# EAGLE design Testadapter (EAGLE 9.6.2)
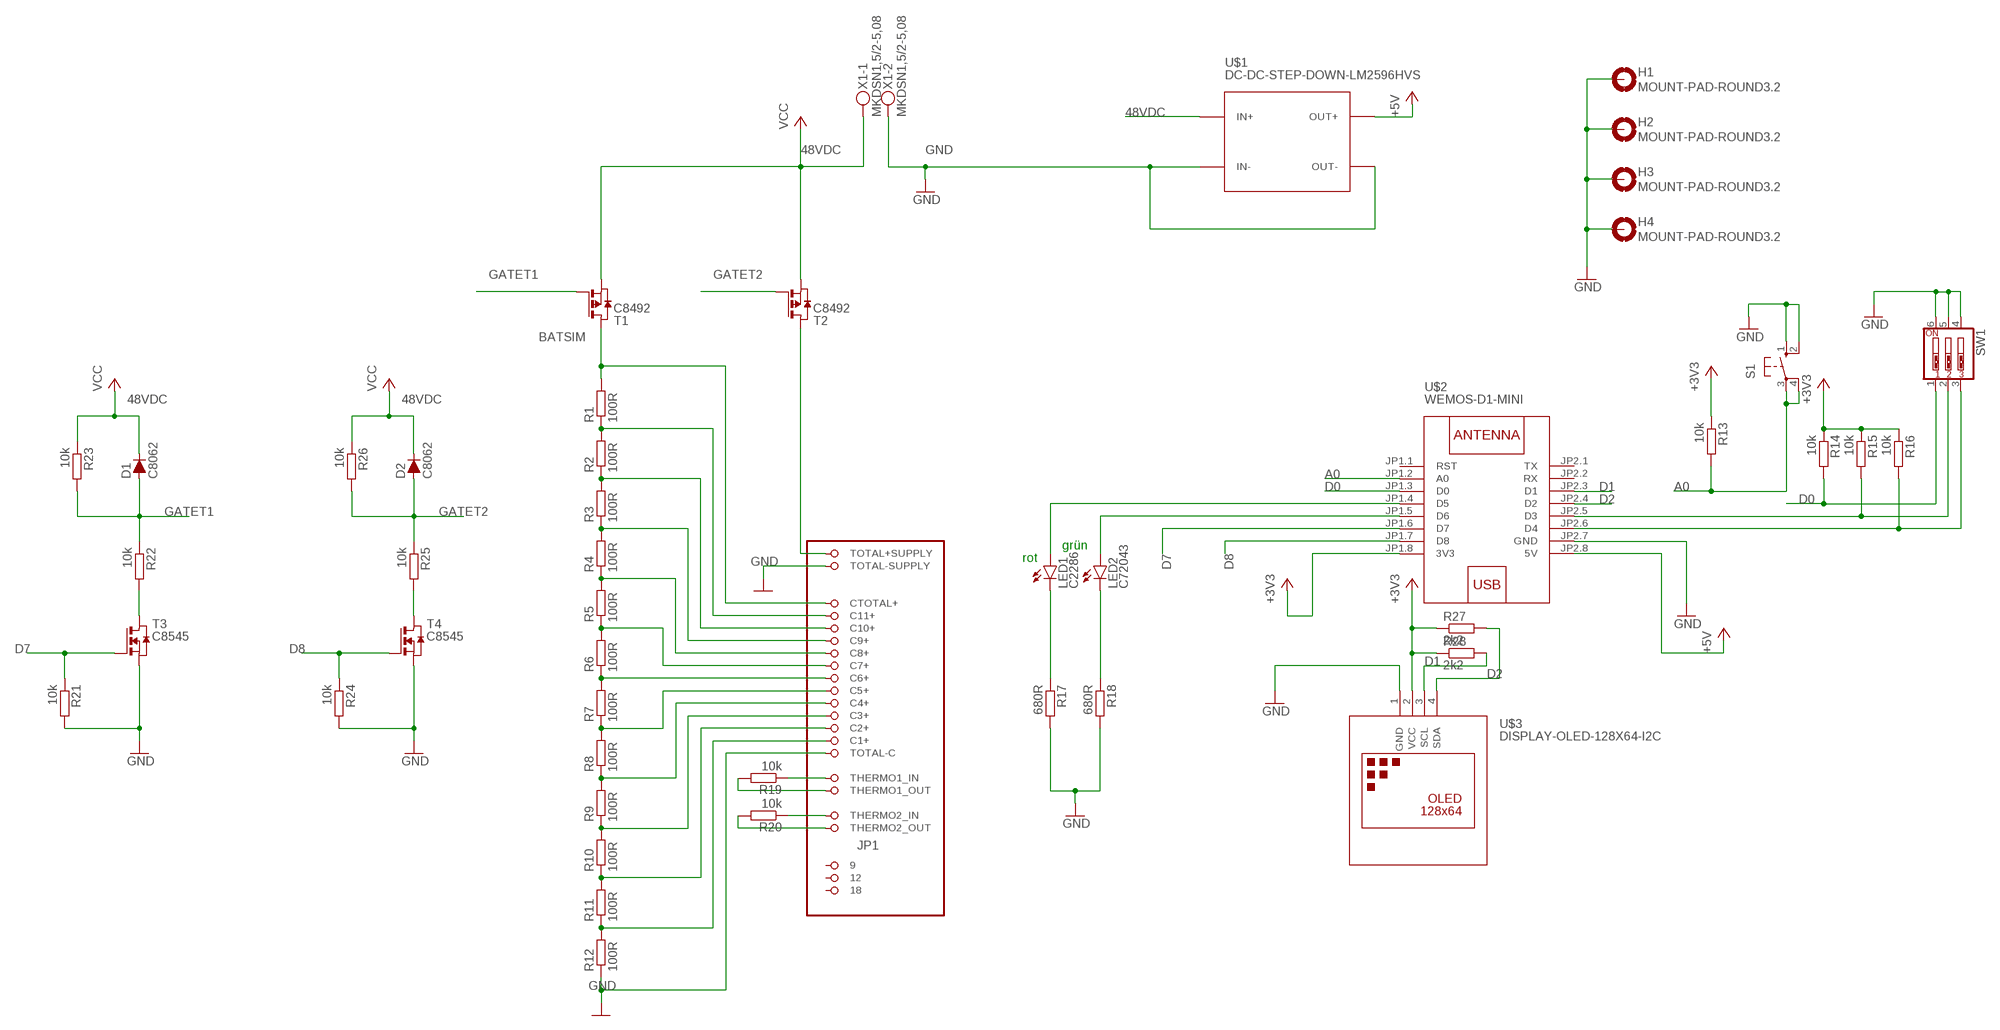
[diagram p0: schematic, sheet 1]

## Parts
D1  C8062  D-FILL-MLL-34  [MELF-MLL34]
D2  C8062  D-FILL-MLL-34  [MELF-MLL34]
H1  MOUNT-PAD-ROUND3.2  [3,2-PAD]
H2  MOUNT-PAD-ROUND3.2  [3,2-PAD]
H3  MOUNT-PAD-ROUND3.2  [3,2-PAD]
H4  MOUNT-PAD-ROUND3.2  [3,2-PAD]
JP1  PINHD-2X11_MEB12S_MODULSEITE_SMD  [2X11_MEB12S_MODULSEITE_SMD]
LED1  C2286  LEDCHIP-LED0603  [CHIP-LED0603]
LED2  C72043  LEDCHIP-LED0603  [CHIP-LED0603]
R1  100R  R-EU_R0805  [R0805]
R2  100R  R-EU_R0805  [R0805]
R3  100R  R-EU_R0805  [R0805]
R4  100R  R-EU_R0805  [R0805]
R5  100R  R-EU_R0805  [R0805]
R6  100R  R-EU_R0805  [R0805]
R7  100R  R-EU_R0805  [R0805]
R8  100R  R-EU_R0805  [R0805]
R9  100R  R-EU_R0805  [R0805]
R10  100R  R-EU_R0805  [R0805]
R11  100R  R-EU_R0805  [R0805]
R12  100R  R-EU_R0805  [R0805]
R13  10k  R-EU_R0805  [R0805]
R14  10k  R-EU_R0805  [R0805]
R15  10k  R-EU_R0805  [R0805]
R16  10k  R-EU_R0805  [R0805]
R17  680R  R-EU_R0805  [R0805]
R18  680R  R-EU_R0805  [R0805]
R19  10k  R-EU_R0805  [R0805]
R20  10k  R-EU_R0805  [R0805]
R21  10k  R-EU_R0805  [R0805]
R22  10k  R-EU_R0805  [R0805]
R23  10k  R-EU_R0805  [R0805]
R24  10k  R-EU_R0805  [R0805]
R25  10k  R-EU_R0805  [R0805]
R26  10k  R-EU_R0805  [R0805]
R27  2k2  R-EU_R0805  [R0805]
R28  2k2  R-EU_R0805  [R0805]
S1  10-XX  [B3F-10XX]
SW1  SW_DIP-3  [EDG-03]
T1  C8492  PMOSSOT23  [SOT-23]
T2  C8492  PMOSSOT23  [SOT-23]
T3  C8545  NMOSSOT23  [SOT-23]
T4  C8545  NMOSSOT23  [SOT-23]
U$1  DC-DC-STEP-DOWN-LM2596HVS  [DC-DC-STEP-DOWN-LM2596HVS]
U$2  WEMOS-D1-MINI  [WEMOS-D1-MINI]
U$3  DISPLAY-OLED-128X64-I2C  [DISPLAY-OLED-128X64-I2C]
X1  MKDSN1,5/2-5,08  [MKDSN1,5/2-5,08]

## Nets
48VDC [Supply]: D1.1(C) D2.1(C) R23.1 R26.1 T1.2(S) T2.2(S) U$1.IN+ X1.1 ; supply symbol labelled VCC
+3V3 [Supply]: R13.1 R14.1 R15.1 R16.1 R27.1 R28.1 U$2.JP1.8(3V3) U$3.2(VCC)
+5V [Supply]: U$1.OUT+ U$2.JP2.8(5V)
A0: R13.2 S1.3(P) S1.4(P1) U$2.JP1.2(A0)
BATSIM: JP1.21(CTOTAL+) R1.2 T1.1(D)
D0: R14.2 SW1.1 U$2.JP1.3(D0)
D1: R28.2 U$2.JP2.3(D1) U$3.3(SCL)
D2: R27.2 U$2.JP2.4(D2) U$3.4(SDA)
D7: R21.1 T3.3(G) U$2.JP1.6(D7)
D8: R24.1 T4.3(G) U$2.JP1.7(D8)
GATET1: D1.2(A) R22.1 R23.2 T1.3(G)
GATET2: D2.2(A) R25.1 R26.2 T2.3(G)
GND [Supply]: H1.B3,2(MOUNT) H2.B3,2(MOUNT) H3.B3,2(MOUNT) H4.B3,2(MOUNT) JP1.7(TOTAL-SUPPLY) JP1.9(TOTAL-C) R12.1 R17.2 R18.2 R21.2 R24.2 S1.1(S) S1.2(S1) SW1.4 SW1.5 SW1.6 T3.2(S) T4.2(S) U$1.IN- U$1.OUT- U$2.JP2.7(GND) U$3.1(GND) X1.2
N$1: JP1.20(C11+) R1.1 R2.2
N$2: JP1.19(C10+) R2.1 R3.2
N$3: JP1.18(C9+) R3.1 R4.2
N$4: JP1.17(C8+) R4.1 R5.2
N$5: JP1.16(C7+) R5.1 R6.2
N$6: JP1.15(C6+) R6.1 R7.2
N$7: JP1.14(C5+) R7.1 R8.2
N$8: JP1.13(C4+) R8.1 R9.2
N$9: JP1.12(C3+) R9.1 R10.2
N$10: JP1.11(C2+) R10.1 R11.2
N$11: JP1.10(C1+) R11.1 R12.2
N$14: R15.2 SW1.2 U$2.JP2.5(D3)
N$15: R16.2 SW1.3 U$2.JP2.6(D4)
N$16: LED1.C R17.1
N$17: LED2.C R18.1
N$19 [Supply]: JP1.22(TOTAL+SUPPLY) T2.1(D)
N$20: LED2.A U$2.JP1.5(D6)
N$21: LED1.A U$2.JP1.4(D5)
N$22: R22.2 T3.1(D)
N$23: R25.2 T4.1(D)
THERMO1IN: JP1.1(THERMO1_IN) R19.1
THERMO1OUT: JP1.3(THERMO1_OUT) R19.2
THERMO2_IN: JP1.2(THERMO2_IN) R20.1
THERMO2_OUT: JP1.4(THERMO2_OUT) R20.2
Unconnected: JP1.5 JP1.6 JP1.8 U$2.JP1.1(RST) U$2.JP2.1(TX) U$2.JP2.2(RX)

## Notes on the sheet
- grün
- rot

## Library data of the parts
D1 D2 = semicon-smd-ipc:D-FILL-: DIODE filled
H1-H4 = holes:MOUNT-PAD-ROUND: MOUNTING PAD, round
JP1 = con-MEB:PINHD-2X11_MEB12S_MODULSEITE: PIN HEADER
LED1 LED2 = led:LED: LED OSRAM: - CHIPLED LG R971, LG N971, LY N971, LG Q971, LY Q971, LO R971, LY R971 LH N974, LH R974 LS Q976, LO Q976, LY Q976 LO Q996 - Hyper CHIPLED LW Q18S LB Q993, LB Q99A, LB R99A - SideLED LS A670, LO A670, LY A670, LG A670, LP A670 LB A673, LV A673, LT A673, LW A673 LH A674 LY A675 LS A676, LA A676, LO A676, LY A676, LW A676 LS A679, LY A679, LG A679 - Hyper Micro SIDELED® LS Y876, LA Y876, LO Y876, LY Y876 LT Y87S - SmartLED LW L88C, LW L88S LB L89C, LB L89S, LG L890 LS L89K, LO L89K, LY L89K LS L896, LA L896, LO L896, LY L896 - TOPLED LS T670, LO T670, LY T670, LG T670, LP T670 LSG T670, LSP T670, LSY T670, LOP T670, LYG T670 LG T671, LOG T671, LSG T671 LB T673, LV T673, LT T673, LW T673 LH T674 LS T676, LA T676, LO T676, LY T676, LB T676, LH T676, LSB T676, LW T676 LB T67C, LV T67C, LT T67C, LS T67K, LO T67K, LY T67K, LW E67C LS E67B, LA E67B, LO E67B, LY E67B, LB E67C, LV E67C, LT E67C LW T67C LS T679, LY T679, LG T679 LS T770, LO T770, LY T770, LG T770, LP T770 LB T773, LV T773, LT T773, LW T773 LH T774 LS E675, LA E675, LY E675, LS T675 LS T776, LA T776, LO T776, LY T776, LB T776 LHGB T686 LT T68C, LB T68C - Hyper Mini TOPLED® LB M676 - Mini TOPLED Santana® LG M470 LS M47K, LO M47K, LY M47K Source: http://www.osram.convergy.de LUXEON: - LUMILED® LXK2-PW12-R00, LXK2-PW12-S00, LXK2-PW14-U00, LXK2-PW14-V00 LXK2-PM12-R00, LXK2-PM12-S00, LXK2-PM14-U00 LXK2-PE12-Q00, LXK2-PE12-R00, LXK2-PE12-S00, LXK2-PE14-T00, LXK2-PE14-U00 LXK2-PB12-K00, LXK2-PB12-L00, LXK2-PB12-M00, LXK2-PB14-N00, LXK2-PB14-P00, LXK2-PB14-Q00 LXK2-PR12-L00, LXK2-PR12-M00, LXK2-PR14-Q00, LXK2-PR14-R00 LXK2-PD12-Q00, LXK2-PD12-R00, LXK2-PD12-S00 LXK2-PH12-R00, LXK2-PH12-S00 LXK2-PL12-P00, LXK2-PL12-Q00, LXK2-PL12-R00 Source: www.luxeon.com KINGBRIGHT: KA-3528ASYC Source: www.kingbright.com
R1-R28 = rcl:R-EU_: RESISTOR, European symbol; SPICEPREFIX: R
S1 = switch-omron:10-XX: OMRON SWITCH; MPN: B3F-1000; OC_FARNELL: 176432; OC_NEWARK: 36M3542
SW1 = special:SW_DIP-3: DIP SWITCH
T1 T2 = zetex:PMOSSOT23: MOS FET; OC_FARNELL: unknown; OC_NEWARK: unknown
T3 T4 = zetex:NMOSSOT23: MOS FET; OC_FARNELL: unknown; OC_NEWARK: unknown
U$1 = diy-modules:DC-DC-STEP-DOWN-LM2596HVS: DC/DC Step-Down Regulator based on LM2596-ADJ chip LM2596 datasheet available here: http://www.ti.com/lit/ds/symlink/lm2596.pdf Click here to find device on ebay.com <http://www.ebay.com/sch/lm2596+power+regulator>
U$2 = diy-modules:WEMOS-D1-MINI: WEMOS D1 mini: Mini Wi-Fi Board based on ESP-8266 device More details can be found here: https://www.wemos.cc/product/d1-mini.html Click here to find device on ebay.com <http://www.ebay.com/sch/wemos+d1+mini+nodemcu>
U$3 = diy-modules:DISPLAY-OLED-128X64-I2C: 128x64 Dot Matrix OLED Module based on SSD1306 chip Variant with I2C interface More details available here: http://www.instructables.com/id/Monochrome-096-i2c-OLED-display-with-arduino-SSD13/ SSD1306 datasheet: https://cdn-shop.adafruit.com/datasheets/SSD1306.pdf Click here to find device on ebay.com <http://www.ebay.com/sch/oled+display+128x64+iic> Note: There are two variants: I2C and SPI. Search for the proper version.
X1 = con-phoenix-508:MKDSN1,5/2-5,08: MKDSN 1,5/ 2-5,08 Printklemme Nennstrom: 13,5 A Nennspannung: 250 V Rastermaß: 5,08 mm Polzahl: 2 Anschlussart: Schraubanschluss Montage: Löten Anschlussrichtung Leiter/Platine: 0 ° Artikelnummer: 1729128 Source: http://eshop.phoenixcontact.com .. 1729128.pdf

## Net classes
0 default: width 0.2 mm, clearance 0.205 mm
1 Supply: width 1 mm, clearance 0.205 mm

## Board
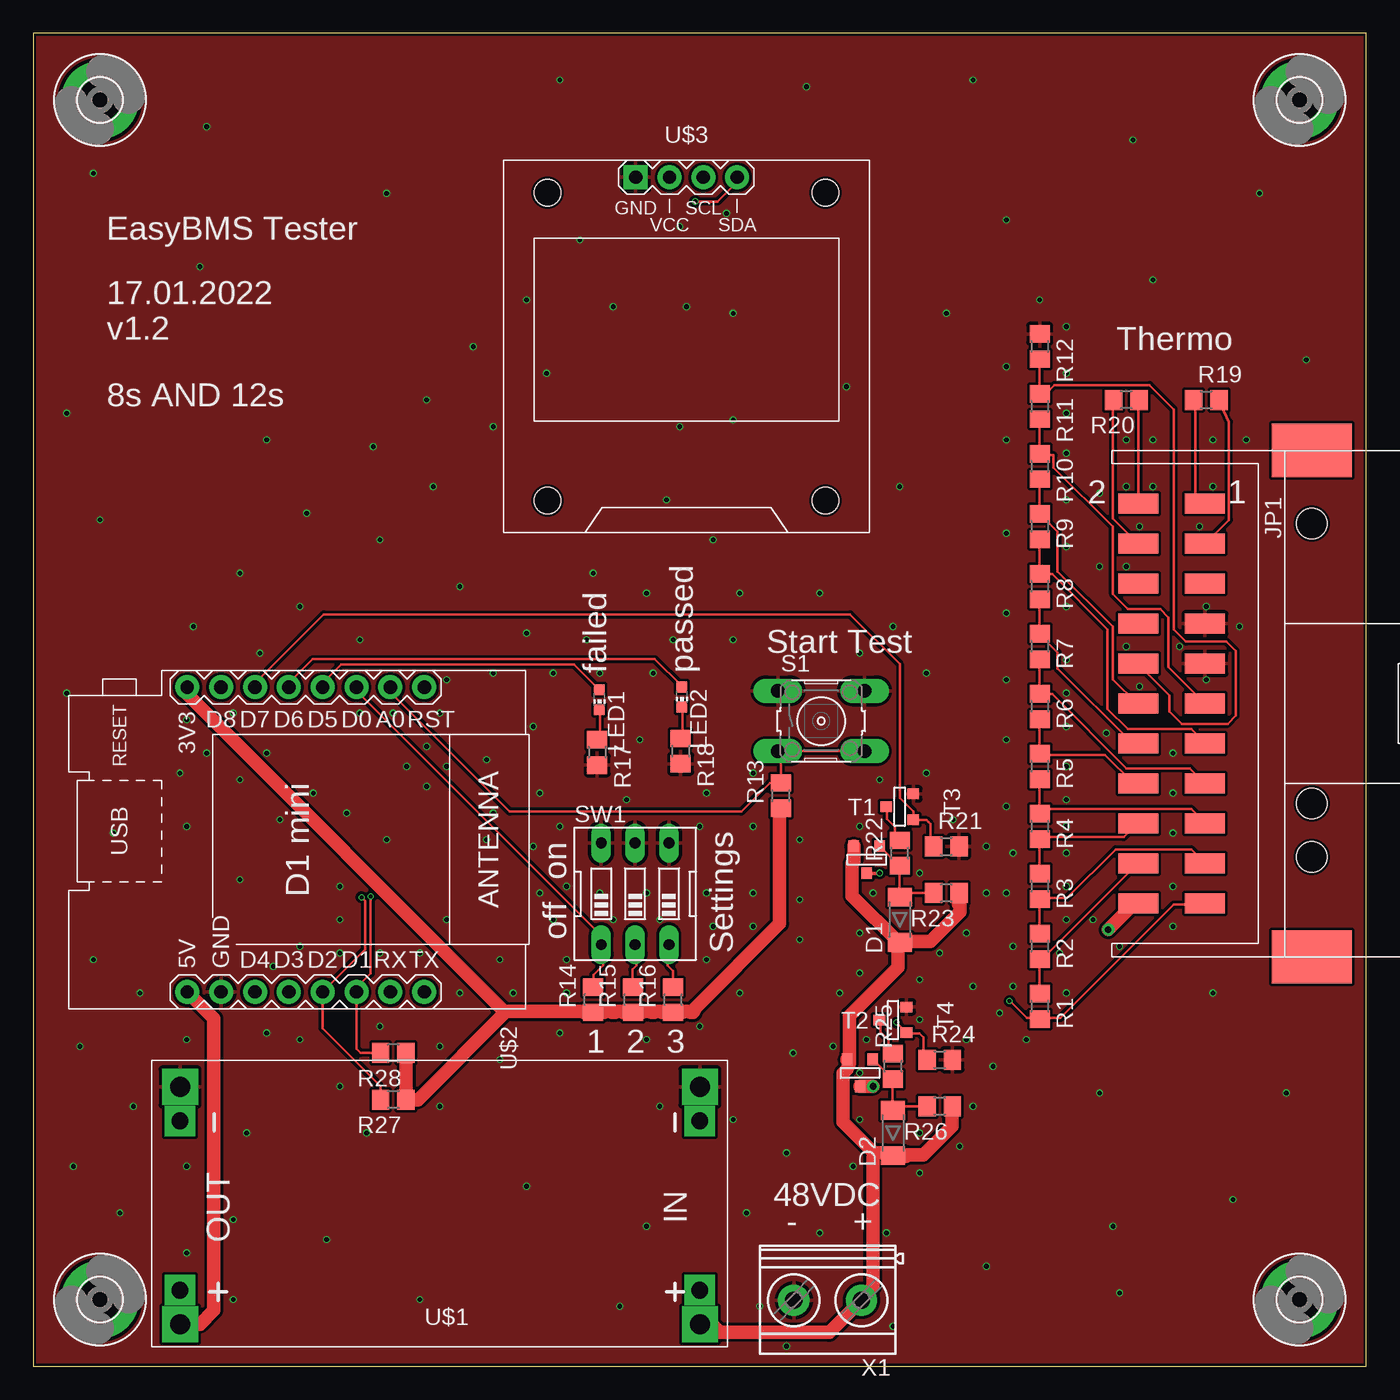
[diagram p1: board, top side]
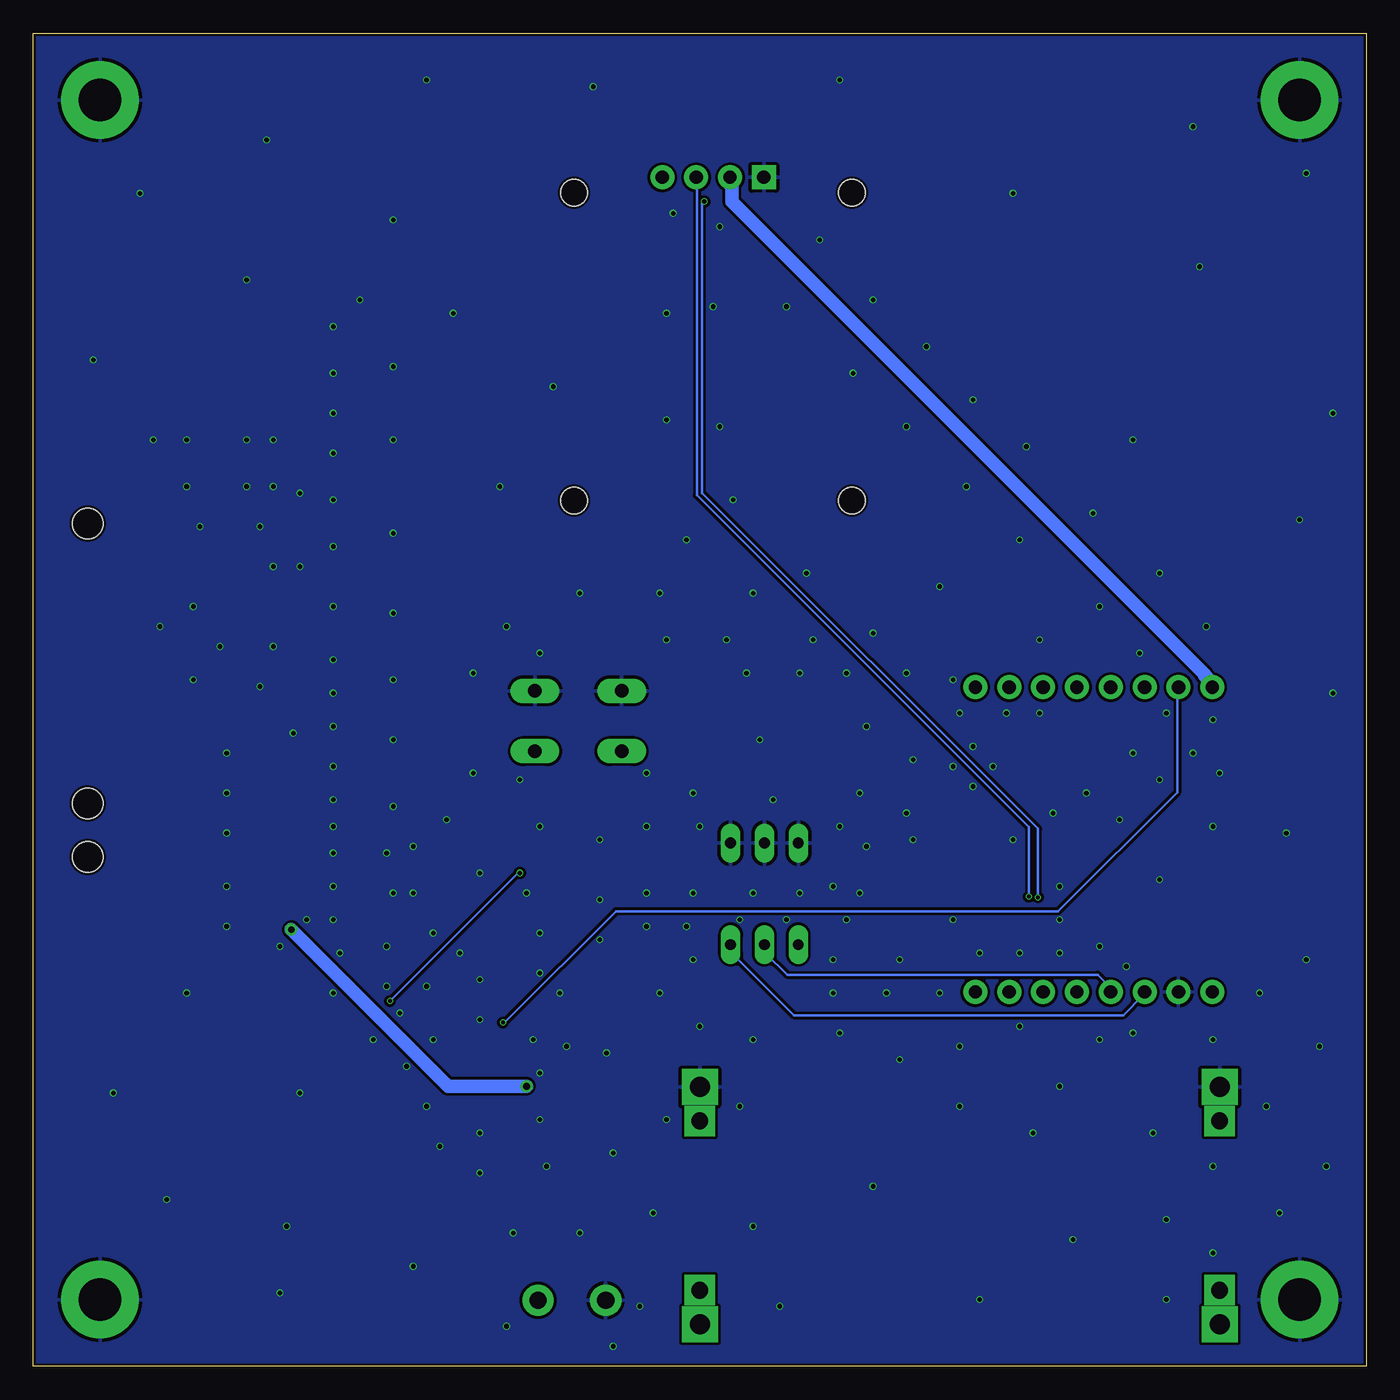
[diagram p2: board, bottom side, seen from below]

Size 100 x 100 mm. Coordinates in mm from the lower left corner, seen from the top.
Outline: 0,0 100,0 100,100 0,100 0,0
Copper layers (1*16): Top 0.035mm / dielectric 1.6mm / Bottom 0.035mm
Design rules "jlcpcb-2layers *": minimum track width 5mil, minimum drill 0.3mm, track to track 5mil, track to pad 5mil, pad to pad 5mil, via to via 5mil, smd to smd 5mil, copper to edge 0.2mm, drill to drill 6mil, minimum pad ring 10mil, minimum via ring 3mil, stop-mask expansion 4mil, vias tented up to drill 20mil, thermal gap 10mil

### Footprints (pad centres in the part's own frame; a part is rotated, then mirrored left to right if it is on the bottom)
MELF-MLL34 = smd 1.4 x 1.8: 1 -1.7,0; 2 1.7,0
3,2-PAD = drill 3.2 pad 5.842: B3,2 0,0
2X11_MEB12S_MODULSEITE_SMD = smd 1.5 x 3: 1 -15,0; 2 -15,-5; 3 -12,0; 4 -12,-5; 5 -9,0; 6 -9,-5; 7 -6,0; 8 -6,-5; 9 -3,0; 10 -3,-5; 11 0,0; 12 0,-5; 13 3,0; 14 3,-5; 15 6,0; 16 6,-5; 17 9,0; 18 9,-5; 19 12,0; 20 12,-5; 21 15,0; 22 15,-5 | smd 4 x 6: P$1 -19,8; P$2 19,8 | hole 2.3: -13.5,8; 7.5,8; 11.5,8
CHIP-LED0603 = smd 0.8 x 0.8: A 0,-0.75; C 0,0.75
R0805 = smd 1.3 x 1.5: 1 -0.95,0; 2 0.95,0
B3F-10XX = drill 1.016 long: 1 -3.251,2.261; 2 3.251,2.261; 3 -3.251,-2.261; 4 3.251,-2.261
EDG-03 = drill 0.813 long: 1 -2.54,-3.81; 2 0,-3.81; 3 2.54,-3.81; 4 2.54,3.81; 5 0,3.81; 6 -2.54,3.81
SOT-23 = smd 0.787 x 0.889: 1 0.025,-1.016; 2 -0.94,1.016; 3 0.991,1.016
DC-DC-STEP-DOWN-LM2596HVS = drill 1.5 pad 2.5 square: IN+ 0,17.78; IN- 0,0; OUT+ 39,17.78; OUT- 39,0 | drill 1.27 pad 1.676 square: P$1 0,15.24; P$6 0,2.54; P$7 39,15.24; P$8 39,2.54
WEMOS-D1-MINI = drill 1: JP1.1 -11.43,9.525; JP1.2 -11.43,6.985; JP1.3 -11.43,4.445; JP1.4 -11.43,1.905; JP1.5 -11.43,-0.635; JP1.6 -11.43,-3.175; JP1.7 -11.43,-5.715; JP1.8 -11.43,-8.255; JP2.1 11.43,9.525; JP2.2 11.43,6.985; JP2.3 11.43,4.445; JP2.4 11.43,1.905; JP2.5 11.43,-0.635; JP2.6 11.43,-3.175; JP2.7 11.43,-5.715; JP2.8 11.43,-8.255
DISPLAY-OLED-128X64-I2C = drill 1 square: 1 -3.81,12.7 | drill 1: 2 -1.27,12.7; 3 1.27,12.7; 4 3.81,12.7 | hole 2: -10.414,11.557; 10.414,11.557; 10.414,-11.557; -10.414,-11.557
MKDSN1,5/2-5,08 = drill 1.3 pad 2: 1 -2.561,0.025; 2 2.519,0.025

### Placement (x,y rotation side)
D1  65,33.5 90 top
D2  64.5,17.5 90 top
H1  5,95 0 top
H2  95,5 0 top
H3  95,95 0 top
H4  5,5 0 top
JP1  87.9,49.71 270 top
LED1  42.47,50.01 180 top
LED2  48.65,50.21 180 top
R1  75.5,27 270 top
R2  75.5,31.5 270 top
R3  75.5,36 270 top
R4  75.5,40.5 270 top
R5  75.5,45 270 top
R6  75.5,49.5 270 top
R7  75.5,54 270 top
R8  75.5,58.5 270 top
R9  75.5,63 270 top
R10  75.5,67.5 270 top
R11  75.5,72 270 top
R12  75.5,76.5 270 top
R13  56.09,42.81 90 top
R14  42,27.5 90 top
R15  45,27.5 90 top
R16  48,27.5 90 top
R17  42.31,46.05 270 top
R18  48.56,46.15 270 top
R19  88,72.5 0 top
R20  82,72.5 180 top
R21  68.5,39 0 top
R22  65,38.5 90 top
R23  68.5,35.5 180 top
R24  68,23 0 top
R25  64.5,22.5 90 top
R26  68,19.5 180 top
R27  27,20 180 top
R28  27,23.5 180 top
S1  59.11,48.4 0 top
SW1  45.15,35.44 0 top
T1  62.5,38 0 top
T2  62,22 0 top
T3  65,42 270 top
T4  64.5,26 270 top
U$1  50,20.94 180 top
U$2  19.8,39.51 270 top
U$3  49,76.5 0 top
X1  59.57,4.97 180 top

### Tracks (layer width: path | path; a pad name or v marks a point on that pad's centre or on a via)
48VDC
  Top 1: D1.1 64.96,31.76 61.43,35.29 61.43,37.72 61.56,37.85 T1.2 | R23.1 69.42,35.4 69.42,34.69 69.52,34.59 69.52,34.09 67.29,31.86 65.47,31.86 D1.1 | R26.1 68.91,19.4 68.91,17.99 66.79,15.86 65.57,15.86 65.47,15.76 64.96,15.76 D2.1 63.99,16 63.08,16 | U$1.IN+ 50.01,3.14 50.93,3.14 51.54,2.53 59.72,2.53 X1.1 62.37,5.37 62.98,5.97 62.98,15.59 63.08,16 | 61.22,22.98 61.22,22.73 61.05,22.27 60.75,21.97 60.75,18.33 63.08,16 | 61.22,22.98 61.22,26.29 64.86,29.93 64.86,31.25 D1.1 | T2.2 61.05,22.98 61.22,22.98
+3V3
  Top 1: 35.48,26.63 35.34,26.63 11.54,50.42 U$2.JP1.8 | 35.48,26.63 28.85,20 R27.1 R28.1 | 35.48,26.63 41.21,26.63 41.31,26.53 41.51,26.53 R14.1 42.02,26.53 42.83,26.53 42.93,26.63 43.34,26.63 43.44,26.53 43.64,26.53 43.74,26.63 44.15,26.63 44.25,26.53 44.95,26.53 R15.1 45.46,26.53 45.66,26.53 45.77,26.63 46.27,26.63 46.37,26.53 46.58,26.53 46.68,26.63 47.08,26.63 47.18,26.53 47.99,26.53 R16.1 48.5,26.53 48.7,26.53 48.8,26.63 49.21,26.63 49.31,26.53 49.51,26.53 49.71,26.93 55.99,33.21 55.99,41.82 R13.1
  Bottom 1: U$3.2 47.69,89.1 47.69,88.59 47.59,88.49 47.59,87.38 12.15,51.94 12.15,51.84 11.64,51.33 11.64,51.03 U$2.JP1.8
+5V
  Top 1: U$1.OUT+ 12.5,3.16 13.54,4.2 13.54,26.08 U$2.JP2.8
A0
  Top 0.2: 56.14,43.85 R13.2 | U$2.JP1.2 26.83,50.93 26.83,50.52 35.74,41.61 53.12,41.61 55.27,43.76 R13.2 | 56.5,46.14 S1.4 | R13.2 56.09,45.73 56.5,46.14 | S1.3 56.5,46.14
BATSIM  (via drill 0.3, 0.35)
  Top 0.2: v73.25,27.39 74.53,26.12 75.43,26.12 R1.2 75.63,26.12 77.05,26.12 85.56,34.63 87.89,34.63 JP1.21
  Top 0.254: T1.1 63.48,36.98 v63.5,37
  Bottom 0.2: v73.25,27.39 63.69,36.96 63.59,36.96 v63.5,37
D0
  Top 0.2: R14.2 42.02,28.45 42.02,29.36 42.73,30.07 42.73,31.49 42.63,31.59 SW1.1 42.52,31.69 42.52,32.4 24.3,50.62 24.3,50.93 U$2.JP1.3
D1  (via drill 0.3)
  Top 0.2: v25.31,35.23 25.31,29.46 24.3,28.45 24.3,28.15 U$2.JP2.3 24.25,23.8 24.55,23.5 R28.2
  Bottom 0.2: v25.31,35.23 25.31,40.45 50.22,65.36 50.22,89.1 U$3.3
D2  (via drill 0.3, 0.35)
  Top 0.2: v49.66,87.38 51.33,87.38 52.75,88.8 52.75,89.1 U$3.4 | v24.63,35.18 24.78,35.03 24.78,35.02 24.91,34.89 24.91,31.28 U$2.JP2.4 21.7,25.34 26.05,21 R27.2
  Bottom 0.2: v24.63,35.18 24.63,40.34 49.81,65.52 49.81,87.23 v49.66,87.38
D7
  Top 0.2: R21.1 67.5,39.05 67.29,39.25 67.29,40.67 67.14,40.82 66.99,40.97 66.08,40.97 T3.3 66.02,41.11 66.02,41.61 65,42.63 65,52.68 61.27,56.41 21.78,56.41 16.71,51.33 16.71,51.03 U$2.JP1.6
D8  (via drill 0.3)
  Top 0.2: R24.1 66.99,23.05 66.79,23.25 66.79,24.67 66.48,24.97 65.57,24.97 T4.3 65.47,25.07 v64.76,25.78
  Bottom 0.2: U$2.JP1.7 14.18,50.93 14.18,43.06 23.12,34.12 23.5,34.12 56.3,34.12 64.6,25.82 64.7,25.82 v64.76,25.78
GATET1
  Top 0.2: R23.2 67.5,35.5 65.27,35.5 65.06,35.3 D1.2 65.17,35.5 64.96,35.7 64.96,37.43 65,37.46 R22.1 64.96,37.55 T1.3
GATET2
  Top 0.2: R26.2 66.99,19.5 64.86,19.5 64.56,19.2 D2.2 64.76,19.5 64.46,19.81 64.46,21.43 64.5,21.46 R25.1 64.5,21.57 64.46,21.55 T2.3
GND  (via drill 0.35)
  other vias: 77.5,45 77.5,48 77.5,53 77.5,38.5 77.5,42.5 77.5,36 77.5,33.5 77.5,28 80,20.5 88.5,28 81.5,5.5 90,12.5 77.5,57 77.5,61.5 77.5,65 77.5,68.5 77.5,74.5 66.5,17.5 64,10 62,29.5 66.5,29 70,24.5 73,35.5 73.5,38.5 68,31 70.5,28.5 73,42 70,32.5 72,22.5 70.5,19.5 69.5,16.5 66.5,14.5 59,10 64.5,3 63,35.5 62,40.5 61.5,15 62,32.5 66.5,37 81,10.5 69,41 67,44.5 67,52 54.5,4.5 56.5,1.5 15,11 11.5,15 44,4.5 11.5,8.5 53,28 57,23.5 62,18.5 60,24 56.5,16 59,58 64.5,55.5 62,53.5 52.5,54.5 53,58 48,54.5 41.5,54.5 37,55 32,58.5 24.5,54.5 17,53.5 31,51.5 34.5,52 39,52 42.5,52 46.5,52 45.5,47 30.5,49 34,45.5 38,43 44.5,42.5 50.5,43 54,44.5 27,49 29.5,46.5 31,45 34.5,41.5 39.5,40.5 50,40.5 54,40.5 24.5,49 28,45 29.5,43.5 34,39.5 38,35.5 40,36 37.5,39 42.5,35.5 46,35.5 51,33 54,33 37.5,48 26.5,39.5 23.5,41.5 31,33.5 39,33.5 43.5,33.5 47,33.5 50.5,30.5 57.5,32 50,25.5 21,43 17.5,46 15,49 11.5,48.5 13,46 15.5,44 18.5,41 23,36 23,33.5 23,31 26,31 29,31 11,44.5 11.5,40.5 15.5,36.5 20,31.5 18,30 12,55.5 15.5,59.5 20.5,64 25.5,69 29.5,72.5 33,76.5 37,80 41,84.5 20,57 26,62 30,66 34.5,70.5 38.5,74.5 43.5,79.5 48.5,85.5 49,79.5 52,86.5 52.5,79 52.5,71 48.5,70.5 47.5,65 42,59.5 46,58 51,62 73,75 73,69.5 73,62.5 73,56.5 71.5,39 71.5,35.5 73.5,31.5 73.5,28.5 72.5,26.5 6.5,11.5 7.5,19.5 11.5,24.5 8,28 3.5,24 3,15 46,24.5 39.5,25 30.5,24 32,28 35,30.5 40,30.5 36,28 40,28 26,25.5 17.5,25 22,9.5 16,17.5 37,13.5 29,5 15,5 52.5,18.5 46,10.5 47,19.5 4.5,30.5 6,40 2.5,50.5 2.5,71.5 5,63.5 17.5,69.5 4.5,89.5 12.5,82.5 26.5,88 13,93 39.5,96.5 70.5,96.5 58,96 68.5,79 61,73.5 77.5,71.5 75.5,80 73,86 82.5,92 77.5,78 65,66 92,88 71.5,7.5 53.5,11.5 25,17.5 35,23 30.5,19.5 23,21 20,24.5 62,22 62.5,24.5 74.5,24.5 60.5,28 54,35.5 50.5,35.5 57.5,39.5 57.5,35 63.5,44 73,51.5 73,47 95.5,75.5 84,81.5 94,20.5 77.5,40.5 77.5,50.5 82,69.5 84,69.5 88.5,69.5 91,69.5 82,60 80,60 83,63 80,65.5 87.5,63 88.5,66 84,66 82,66 88,57 88,51.5 82,54 83,51 80.5,47.5 85.5,46 85.5,43 85.5,40 85.5,36 85.5,33 90.5,55.5 86,54 77,31 81.5,31.5 79.5,33.5 66.5,26
  pour Top: 0,100 100.5,100 100.5,0 0,0
  pour Bottom: 0,100 100,100 100,0 0,0
N$1
  Top 0.2: R1.1 75.49,30.49 R2.2 75.63,30.68 75.84,30.68 82.82,37.66 JP1.20
N$2
  Top 0.2: R2.1 75.49,32.51 R3.2 75.63,35.13 77.56,35.13 81.2,38.78 86.87,38.78 87.89,37.77 JP1.19
N$3
  Top 0.2: R3.1 75.49,36.97 75.49,39.5 R4.2 75.63,39.69 81.81,39.69 82.82,40.7 JP1.18
N$4
  Top 0.2: R5.2 75.49,43.95 75.49,41.52 R4.1 75.87,41.82 86.87,41.82 87.89,40.8 JP1.17
N$5
  Top 0.2: 75.49,46.28 75.49,48.51 R6.2 | 75.49,46.28 75.49,45.98 R5.1 | 75.49,46.28 R5.1 | R5.1 75.53,45.87 80.39,45.87 82.52,43.74 82.82,43.74 JP1.16
N$6
  Top 0.2: R7.2 75.49,52.96 75.49,50.53 R6.1 75.61,50.45 75.63,50.42 76.44,50.42 82.01,44.85 86.77,44.85 87.89,43.74 JP1.15
N$7
  Top 0.2: R8.2 75.49,57.52 75.49,54.99 R7.1 75.53,54.88 76.85,53.56 76.85,52.35 82.42,46.78 82.82,46.78 JP1.14
N$8
  Top 0.2: R9.2 75.49,61.98 75.49,59.55 R8.1 75.62,59.45 75.63,59.43 76.44,59.43 80.59,55.28 80.59,49.31 82.11,47.79 86.87,47.79 87.89,46.78 JP1.13
N$9
  Top 0.2: R10.2 75.49,66.53 75.49,64 R9.1 76.85,62.6 76.85,59.64 81,55.48 81,51.54 82.82,49.71 JP1.12
N$10
  Top 0.2: R11.2 75.49,70.99 R10.1 75.59,68.35 76.51,68.35 76.55,68.34 76.55,67.43 81,62.98 81,57.91 82.11,56.8 84.54,56.8 85.16,56.19 85.16,52.44 87.89,49.71 JP1.11
N$11
  Top 0.2: R12.2 75.49,73.01 R11.1 75.95,72.95 76.61,73.61 83.73,73.61 85.56,71.78 85.56,55.28 86.47,54.37 89.5,54.37 90.21,53.66 90.21,48.8 89.6,48.2 86.17,48.2 85.25,49.12 85.25,50.33 82.92,52.65 JP1.10
N$14
  Top 0.2: R15.2 44.95,28.45 44.95,29.77 45.26,30.07 45.26,31.49 45.16,31.59 SW1.2
  Bottom 0.2: U$2.JP2.5 19.24,28.15 19.24,28.45 20.15,29.36 43.44,29.36 45.06,30.98 45.06,31.59 SW1.2
N$15
  Top 0.2: R16.2 47.99,29.67 47.59,30.07 47.59,31.49 47.69,31.59 SW1.3
  Bottom 0.2: U$2.JP2.6 16.71,28.05 16.71,27.84 18.23,26.32 42.93,26.32 47.69,31.08 47.69,31.59 SW1.3
N$16
  Top 0.2: LED1.C 42.52,49.21 42.52,47.28 42.32,47.08 R17.1
N$17
  Top 0.2: LED2.C 48.7,49.41 48.7,47.28 48.6,47.18 R18.1
N$19  (via drill 0.5 pad 0.9)
  Top 1: T2.1 62.04,21 v63,21 | v80.65,32.76 82.51,34.63 82.82,34.63 JP1.22
  Bottom 1: v63,21 68.89,21 v80.65,32.76
N$20
  Top 0.2: LED2.A 48.65,51.02 46.62,53.05 20.96,53.05 19.24,51.33 19.24,51.03 U$2.JP1.5
N$21
  Top 0.2: LED1.A 40.57,52.65 23.09,52.65 21.77,51.33 21.77,51.03 U$2.JP1.4
N$22
  Top 0.2: T3.1 64.05,41.88 64.05,41.07 64.66,40.46 64.66,39.76 64.96,39.45 R22.2
N$23
  Top 0.2: T4.1 63.55,25.88 63.55,25.07 64.15,24.47 64.15,23.76 64.46,23.45 R25.2
THERMO1IN
  Top 0.2: R19.1 87.18,72.39 87.18,65.51 87.89,64.8 JP1.1
THERMO1OUT
  Top 0.2: R19.2 89.71,70.85 89.71,63.48 87.99,61.76 JP1.3
THERMO2_IN
  Top 0.2: JP1.2 82.92,64.8 82.92,72.39 82.95,72.42 R20.1
THERMO2_OUT
  Top 0.2: JP1.4 82.82,61.76 81,63.59 81,72.39 81.05,72.44 R20.2

### Text on the board
tNames: EasyBMS Tester | Thermo | 17.01.2022 / v1.2 | 8s AND 12s | 2 | 1 | Start Test | failed | passed | on | off | Settings | 1 | 2 | 3 | 48VDC | - | +